# EasyEDA Pro project ProPrj_USB-DAC-PRO_2024-06-16.epro, board PCB2
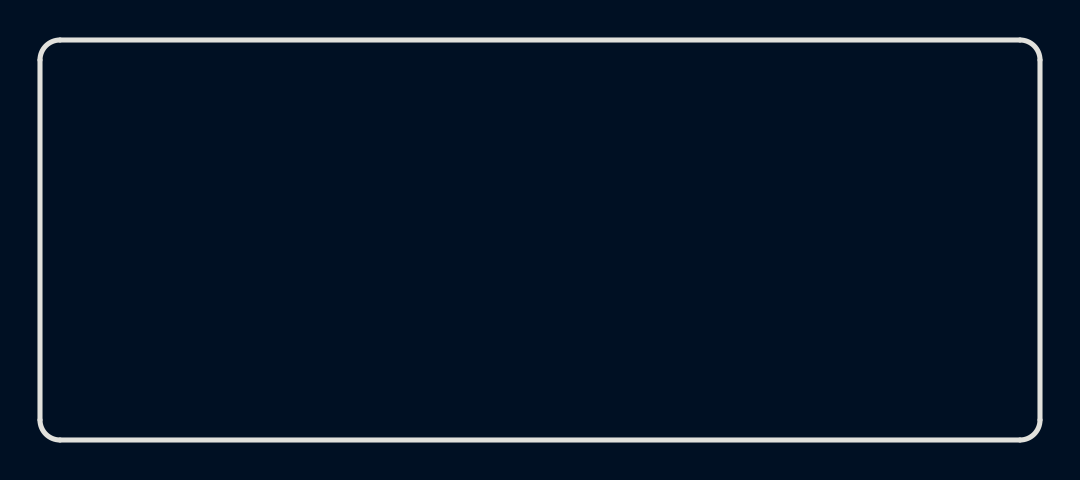
[diagram p8: board, top side]
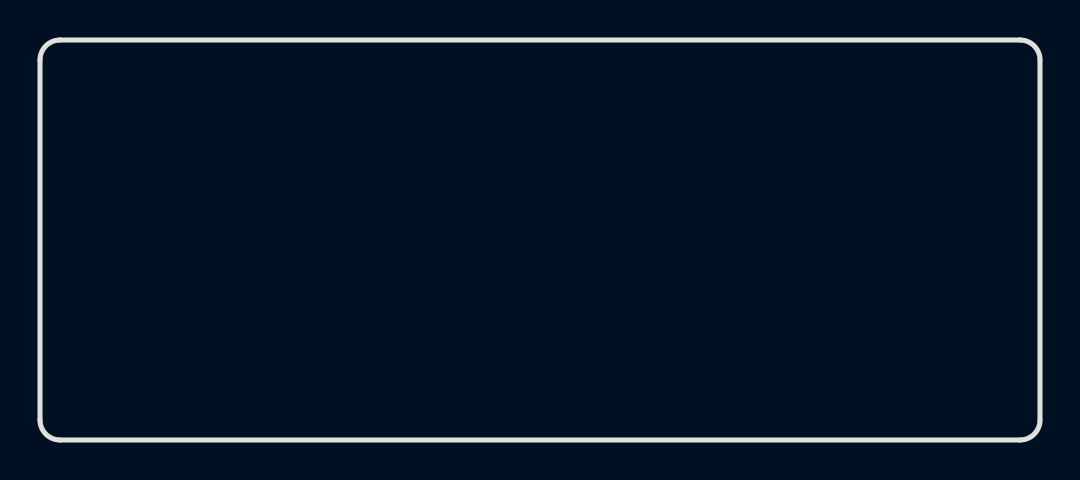
[diagram p9: board, bottom side, seen from below]

Outline 50 x 20 mm; copper layers: Top Layer, Bottom Layer. Coordinates in mm from the lower left corner of the outline.
Outline path: 0,19 0,1 arc(0.29,0.29) 1,0 49,0 arc(49.71,0.29) 50,1 50,19 arc(49.71,19.71) 49,20 1,20 arc(0.29,19.71) 0,19
Stack: Top Layer 0.035mm / Dielectric1 1.51mm FR4 er 4.5 / Bottom Layer 0.035mm

## Design rules (mm)
template: JLCPCB Capability(Two Layers Board)
spacing copperThickness1oz (default): track to track 0.102, other pairs 0.152 to 0.3
spacing copperThickness2oz: track to track 0.203, other pairs 0.152 to 0.3
track width copperThickness1oz (default): min 0.127, default 0.254, max 2.54
track width copperThickness2oz: min 0.203, default 0.254, max 2.54
differential pair differentialPair (default): width min 0.127, default 0.254, max 2.54; gap min 0.152, default 0.152
via viaSize (default): diameter min 0.5, default 0.61, max 10; hole min 0.3, default 0.305, max 6.3

## Placement (name value [footprint] x y rotation side)

## Nets
